# Altium schematic sheet CW308T_ATSAMR21_Micro.SchDoc: SAMR21E Micro & Connectors
size Letter; Organization: NewAE Technology Inc.; Address1: 1083 Queen St., Suite 196; Address2: Halifax; Address3: NS; Address4: Canada B3H 0B2; SheetNumber: 1; SheetTotal: 1; SheetApproved: NO
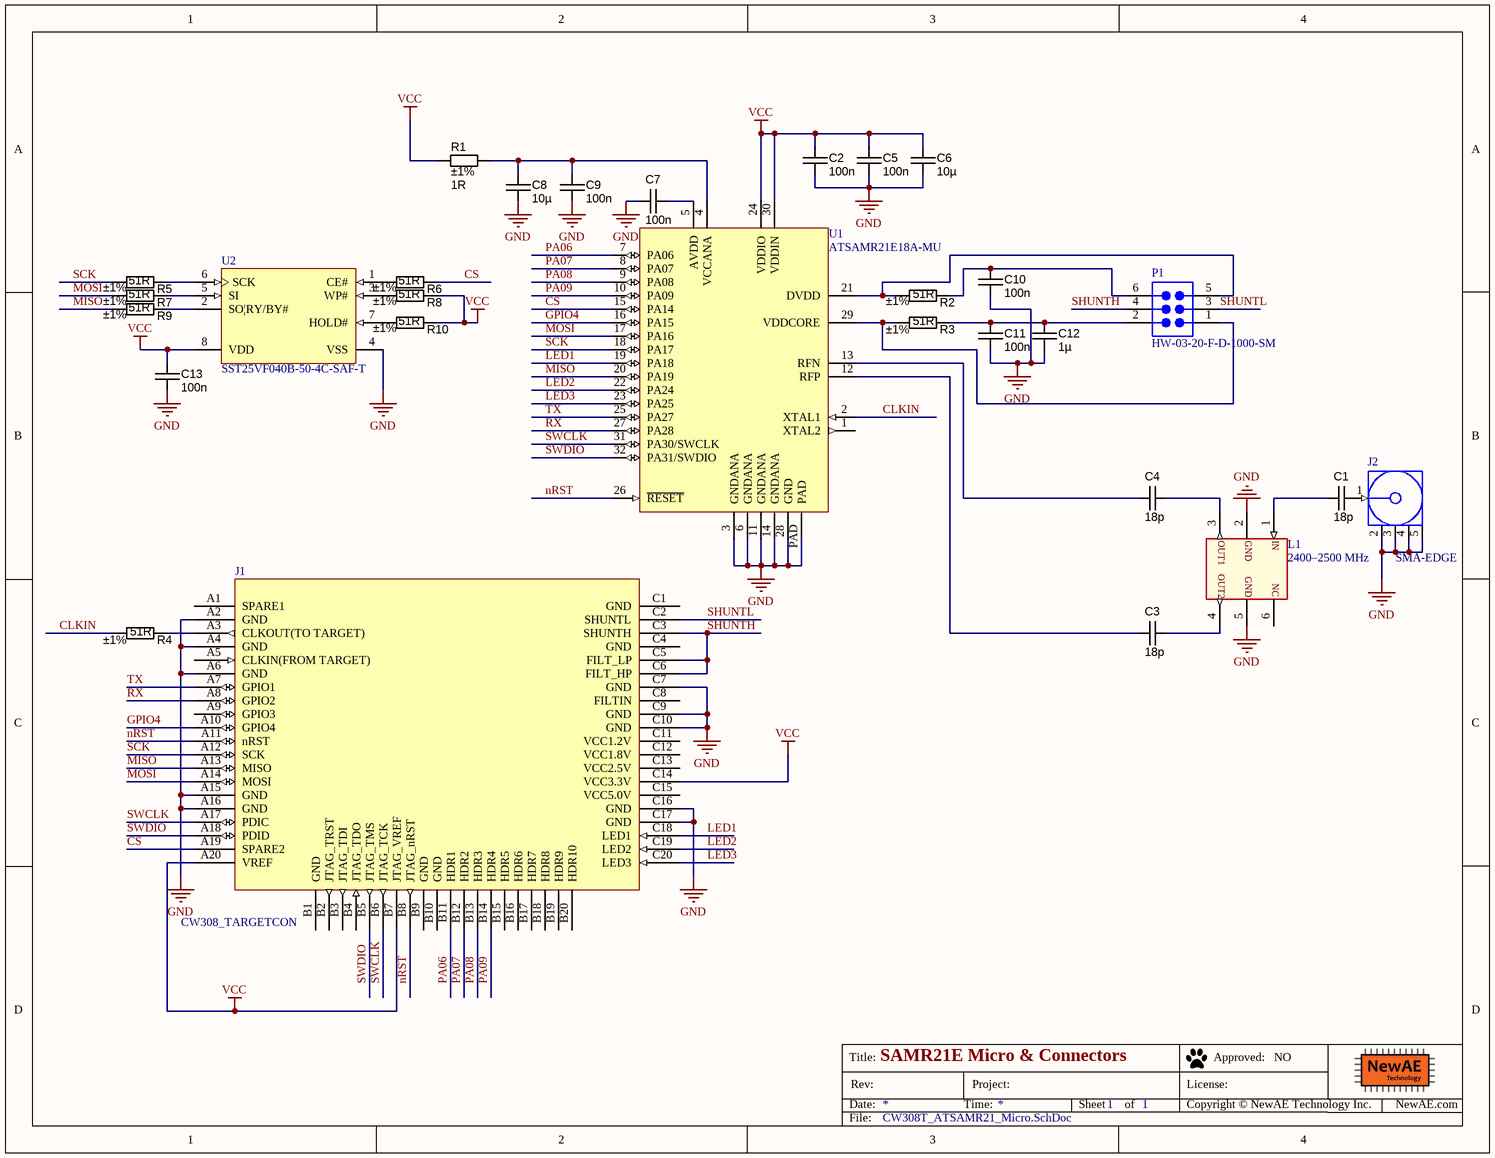
[diagram p0: CW308T_ATSAMR21_Micro.SchDoc]

## Parts
C1  18p  [CAPC1608X90N]
C2  value 100n  [CAPC1608X90N]  (hidden comment: approved sub OK)
C3  18p  [CAPC1608X90N]
C4  18p  [CAPC1608X90N]
C5  value 100n  [CAPC1608X90N]  (hidden comment: approved sub OK)
C6  value 10µ  [CAPC1608X90N]  (hidden comment: approved sub OK)
C7  value 100n  [CAPC1608X90N]  (hidden comment: approved sub OK)
C8  value 10µ  [CAPC1608X90N]  (hidden comment: approved sub OK)
C9  value 100n  [CAPC1608X90N]  (hidden comment: approved sub OK)
C10  value 100n  [CAPC1608X90N]  (hidden comment: approved sub OK)
C11  value 100n  [CAPC1608X90N]  (hidden comment: approved sub OK)
C12  value 1µ  [CAPC1608X90N]  (hidden comment: approved sub OK)
C13  value 100n  [CAPC1608X90N]  (hidden comment: approved sub OK)
J1  CW308_TARGETCON  [CW308_TBOARD_CONN]
J2  SMA-EDGE  [CON-SMAM-PCB-EDGE062]
L1  2400–2500 MHz  [WE-BAL_0603]
P1  HW-03-20-F-D-1000-SM  [SMTC-HW-03-20-X-D-1000-SM]
R1  value 1R  Tolerance: ±1%  [RESC1608X55N]  (hidden comment: Thick Film)
R2  value 51R  Tolerance: ±1%  [RESC1608X55N]  (hidden comment: Thick Film)
R3  value 51R  Tolerance: ±1%  [RESC1608X55N]  (hidden comment: Thick Film)
R4  value 51R  Tolerance: ±1%  [RESC1608X55N]  (hidden comment: Thick Film)
R5  value 51R  Tolerance: ±1%  [RESC1608X55N]  (hidden comment: Thick Film)
R6  value 51R  Tolerance: ±1%  [RESC1608X55N]  (hidden comment: Thick Film)
R7  value 51R  Tolerance: ±1%  [RESC1608X55N]  (hidden comment: Thick Film)
R8  value 51R  Tolerance: ±1%  [RESC1608X55N]  (hidden comment: Thick Film)
R9  value 51R  Tolerance: ±1%  [RESC1608X55N]  (hidden comment: Thick Film)
R10  value 51R  Tolerance: ±1%  [RESC1608X55N]  (hidden comment: Thick Film)
U1  ATSAMR21E18A-MU  [QFN50P500X500X120_HS-33M]
U2  SST25VF040B-50-4C-SAF-T  [MCHP-SOIC-SA8_N]

## Nets
GND: C2.2 C5.2 C6.2 C7.2 C8.2 C9.2 C10.2 C11.2 C12.2 C13.2 J1.A2(GND) J1.A4(GND) J1.A6(GND) J1.A15(GND) J1.A16(GND) J1.C7(GND) J1.C9(GND) J1.C10(GND) J1.C16(GND) J1.C17(GND) J2.2(GND) J2.3(GND) J2.4(GND) J2.5(GND) L1.2(GND) L1.5(GND) U1.3(GNDANA) U1.6(GNDANA) U1.11(GNDANA) U1.14(GNDANA) U1.28(GND) U1.PAD U2.4(VSS)
VCC: C2.1 C5.1 C6.1 C13.1 J1.A20(VREF) J1.B7(JTAG_VREF) J1.C14(VCC3.3V) R1.1 R8.1 R10.1 U1.24(VDDIO) U1.30(VDDIN) U2.8(VDD)
CLKIN: R4.2 U1.2(XTAL1)
CS: J1.A19(SPARE2) R6.1 U1.15(PA14)
GPIO4: J1.A10(GPIO4) U1.16(PA15)
LED1: J1.C18(LED1) U1.19(PA18)
LED2: J1.C19(LED2) U1.22(PA24)
LED3: J1.C20(LED3) U1.23(PA25)
MISO: J1.A13(MISO) R9.2 U1.20(PA19)
MOSI: J1.A14(MOSI) R7.2 U1.17(PA16)
nRST: J1.A11(nRST) J1.B8(JTAG_nRST) U1.26(~{RESET})
PA06: J1.B11(HDR1) U1.7(PA06)
PA07: J1.B12(HDR2) U1.8(PA07)
PA08: J1.B13(HDR3) U1.9(PA08)
PA09: J1.B14(HDR4) U1.10(PA09)
RX: J1.A8(GPIO2) U1.27(PA28)
SCK: J1.A12(SCK) R5.2 U1.18(PA17)
SHUNTH: J1.C3(SHUNTH) J1.C5(FILT_LP) J1.C6(FILT_HP) P1.4
SHUNTL: J1.C2(SHUNTL) P1.3
SWCLK: J1.A17(PDIC) J1.B6(JTAG_TCK) U1.31(PA30/SWCLK)
SWDIO: J1.A18(PDID) J1.B5(JTAG_TMS) U1.32(PA31/SWDIO)
TX: J1.A7(GPIO1) U1.25(PA27)
NetC1_1: C1.1 L1.1(IN)
NetC1_2: C1.2 J2.1(Signal)
NetC3_1: C3.1 U1.12(RFP)
NetC3_2: C3.2 L1.4(OUT2)
NetC4_1: C4.1 U1.13(RFN)
NetC4_2: C4.2 L1.3(OUT1)
NetC7_1: C7.1 U1.5(AVDD)
NetC8_1: C8.1 C9.1 R1.2 U1.4(VCCANA)
NetC10_1: C10.1 P1.6 R2.1
NetC11_1: C11.1 C12.1 P1.2 R3.1
NetJ1_A3: J1.A3(CLKOUT(TO_TARGET)) R4.1
NetP1_1: P1.1 R3.2 U1.29(VDDCORE)
NetP1_5: P1.5 R2.2 U1.21(DVDD)
NetR5_1: R5.1 U2.6(SCK)
NetR6_2: R6.2 U2.1(CE#)
NetR7_1: R7.1 U2.5(SI)
NetR8_2: R8.2 U2.3(WP#)
NetR9_1: R9.1 U2.2(SO|RY/BY#)
NetR10_2: R10.2 U2.7(HOLD#)

Not connected (* = marked no-connect by the designer): J1 A1(SPARE1) A5(CLKIN(FROM_TARGET)) A9(GPIO3) B1(GND) B2(JTAG_TRST) B3(JTAG_TDI) B4(JTAG_TDO) B9(GND) B10(GND) B15(HDR5) B16(HDR6) B17(HDR7) B18(HDR8) B19(HDR9) B20(HDR10) C1(GND) C4(GND) C8(FILTIN) C11(VCC1.2V) C12(VCC1.8V) C13(VCC2.5V) C15(VCC5.0V); L1 6(NC); U1 1(XTAL2)

## Notes on the sheet
- Title:
- Date:
- Rev:
- Time:
- Project:
- Sheet
- of
- License:
- Copyright © NewAE Technology Inc.
- Approved:
- NewAE.com
- File:

## Library data of the parts
C1 C3 C4 = CAPC_18p_0603_100V: Capacitor SMD Cer 18pF 2% 100V NP0 0603; Manufacturer 1: AVX Corporation; Manufacturer Part Number 1: 06031A180GAT2A; Ratings: 100V; NP0; SCDType: spec; Tolerance: ±2%; Operating Temperature: -55°C ~ 125°C; Package / Case: 0603 (1608 Metric); Supplier 1: Digi-Key; Supplier Part Number 1: 478-6025-1-ND; Size / Dimension: 0.063" L x 0.032" W (1.60mm x 0.81mm); Thickness (Max): 0.035" (0.90mm); ComponentLink1URL: http://www.avx.com/docs/Catalogs/ccog.pdf; ComponentLink1Description: http://www.avx.com/docs/Catalogs/ccog.pdf; Value: 18p
C2 C5 C7 C9-C11 C13 = CAPC_100n_0603_X7R_50V_10%: Capacitor SMD Cer 100nF 10% 50V X7R 0603; Manufacturer 1: AVX Corporation; Manufacturer Part Number 1: 06035C104KAT2A; Ratings: 50V; X7R; Material: ceramic; SCDType: spec; Manufacturer 2: TDK Corporation; Manufacturer Part Number 2: C1608X7R1H104K; Package / Case: 0603 (1608 Metric); Tolerance: ±10%; Supplier 1: Digi-Key; Supplier Part Number 1: 478-5052-1-ND; ComponentLink1URL: http://www.avx.com/docs/Catalogs/cx7r.pdf; ComponentLink1Description: http://www.avx.com/docs/Catalogs/cx7r.pdf; Supplier 2: Digi-Key; Supplier Part Number 2: 445-1314-1-ND; ComponentLink2URL: http://product.tdk.com/capacitor/mlcc/en/documents/mlcc_commercial_general_en.pdf; ComponentLink2Description: http://product.tdk.com/capacitor/mlcc/en/documents/mlcc_commercial_general_en.pdf
C6 C8 = CAPC_10u_0603_6V3: Capacitor SMD Cer 10uF 10% 10V X5R 0603; Ratings: 10V; X5R; Material: ceramic; SCDType: spec; Package / Case: 0603 (1608 metric); Tolerance: ±10%; Supplier 1: Digi-Key; Supplier Part Number 1: 490-10474-1-ND
C12 = CAPC_1u_0603_X7R_16V_10%: Capacitor SMD Cer 1uF 10% 16V X7R 0603; Manufacturer 1: TDK Corporation; Manufacturer Part Number 1: C1608X7R1C105K; Ratings: 16V; X7R; Material: ceramic; SCDType: spec; Package / Case: 0603 (1608 metric); Tolerance: ±10%; Supplier 1: Digi-Key; Supplier Part Number 1: 445-1604-1-ND; ComponentLink1URL: http://product.tdk.com/capacitor/mlcc/en/documents/mlcc_commercial_general_en.pdf; ComponentLink1Description: http://product.tdk.com/capacitor/mlcc/en/documents/mlcc_commercial_general_en.pdf
J1 = CW308_TBOARD: CW308 "Standard" Target Board Connector
J2 = CON-SMA-PCBEDGE-003.062: SMA Female Edge Mount Connector for 0.062" Thick Board; PCB_Layout: Pads complies with manufacturer's recommendation.; DatasheetVersion: rev1.0, Aug-2006; PackageVersion: rev1.0, Aug-2006; PackageReference: CON-SMA-EDGE062; PackageDescription: SMA Female Edge Mount Connector for 0.062" Thick Board, 7.9 mm Body Dia.; ComponentLink1Description: Manufacturer URL; ComponentLink1URL: http://www.linxtechnologies.com/; ComponentLink2Description: Datasheet; ComponentLink2URL: http://www.connectorcity.com/diagrams/SMA/CONSMA003.062.pdf
L1 = WE-BAL 0603, 748411245: WE-BAL Multilayer Chip Balun, Frequence=2400–2500 MHz; Manufacturer: Wurth Elektronik; partNo: 748411245; Frequence: 2400–2500 MHz; ComponentLink1Description: Manufacturer; ComponentLink1URL: http://www.we-online.de; Created by: Baojun Chen; Created Date: Nov.2015; ComponentLink2Description: Datasheet; ComponentLink2URL: http://katalog.we-online.de/pbs/datasheet/748411245.pdf
P1 = CMP-1025-00031-1: Manufacturer: Samtec; Pitch: 2.54 mm; Mounting Technology: Surface Mount; ComponentLink1URL: http://www.samtec.com/documents/webfiles/pdf/HW_SM.PDF; PartNumber: HW-03-20-F-D-1000-SM; PackageReference: HW-03-20-X-D-1000-SM; Temperature Range: -55 to 125 degC; RoHS: True; PackageDescription: HW Board to Board Assembly; ComponentLink2Description: Package Specification; PackageVersion: AW, 3/1993; ComponentLink1Description: Datasheet; DatasheetVersion: F-214; ComponentLink2URL: http://www.samtec.com/documents/webfiles/cpdf/HW-XX-XX-XX-X-XXXX-SM-X-XXX-MKT.pdf; Orientation: Vertical
R1 = RES_1R_0603_1%: Resistor SMD chip 1 Ohm 0.1W 1% 0603; Manufacturer 1: Yageo; Manufacturer Part Number 1: RC0603FR-071RL; Ratings: 1/10W; SCDType: spec; Package / Case: 0603 (1608 Metric); Supplier 1: Digi-Key; Supplier Part Number 1: 311-1.00HRCT-ND
R2-R10 = RES_51R_0603_1%: Resistor SMD chip 51 Ohm 0.1W 1% 0603; Manufacturer 1: Yageo; Manufacturer Part Number 1: RC0603FR-0751RL; Ratings: 1/10 W; SCDType: spec; Package / Case: 0603 (1608 metric); Material: Thick Film; Supplier 1: Digi-Key; Supplier Part Number 1: 311-51.0HRCT-ND
U1 = ATSAMR21E18A-MU: Atmel Cortex M0 + 802.15.4 Radio
U2 = CMP-0378-00095-1: 4 Mbit SPI Serial Flash, 2.7 to 3.6 V, 50 MHz, 0 to 70 degC, 8-pin SOIC (SA8), Tape and Reel; Manufacturer: Microchip; DatasheetVersion: Rev. A; ComponentLink1Description: Manufacturer URL; ComponentLink3URL: http://ww1.microchip.com/downloads/en/DeviceDoc/25080A.pdf; ComponentLink2URL: http://ww1.microchip.com/downloads/en/DeviceDoc/25051A.pdf; PackageReference: SOIC-SA8; PackageVersion: Rev. A; ComponentLink1URL: http://www.microchip.com; PartNumber: SST25VF040B-50-4C-SAF-T; PackageDescription: 8-Lead Plastic Small Outline, 4.9 x 3.9 mm Body, 1.27 mm Pitch; ComponentLink2Description: Datasheet; Mounting Technology: Surface Mount; ComponentLink4Description: Product URL; ComponentLink3Description: Package Specification; Code_JEDEC: MS-012; ComponentLink4URL: http://www.microchip.com/SST25VF040B